# Altium schematic sheet Rooftop Unit for AgOpenGPS.schdoc
size 400 x 287 mm
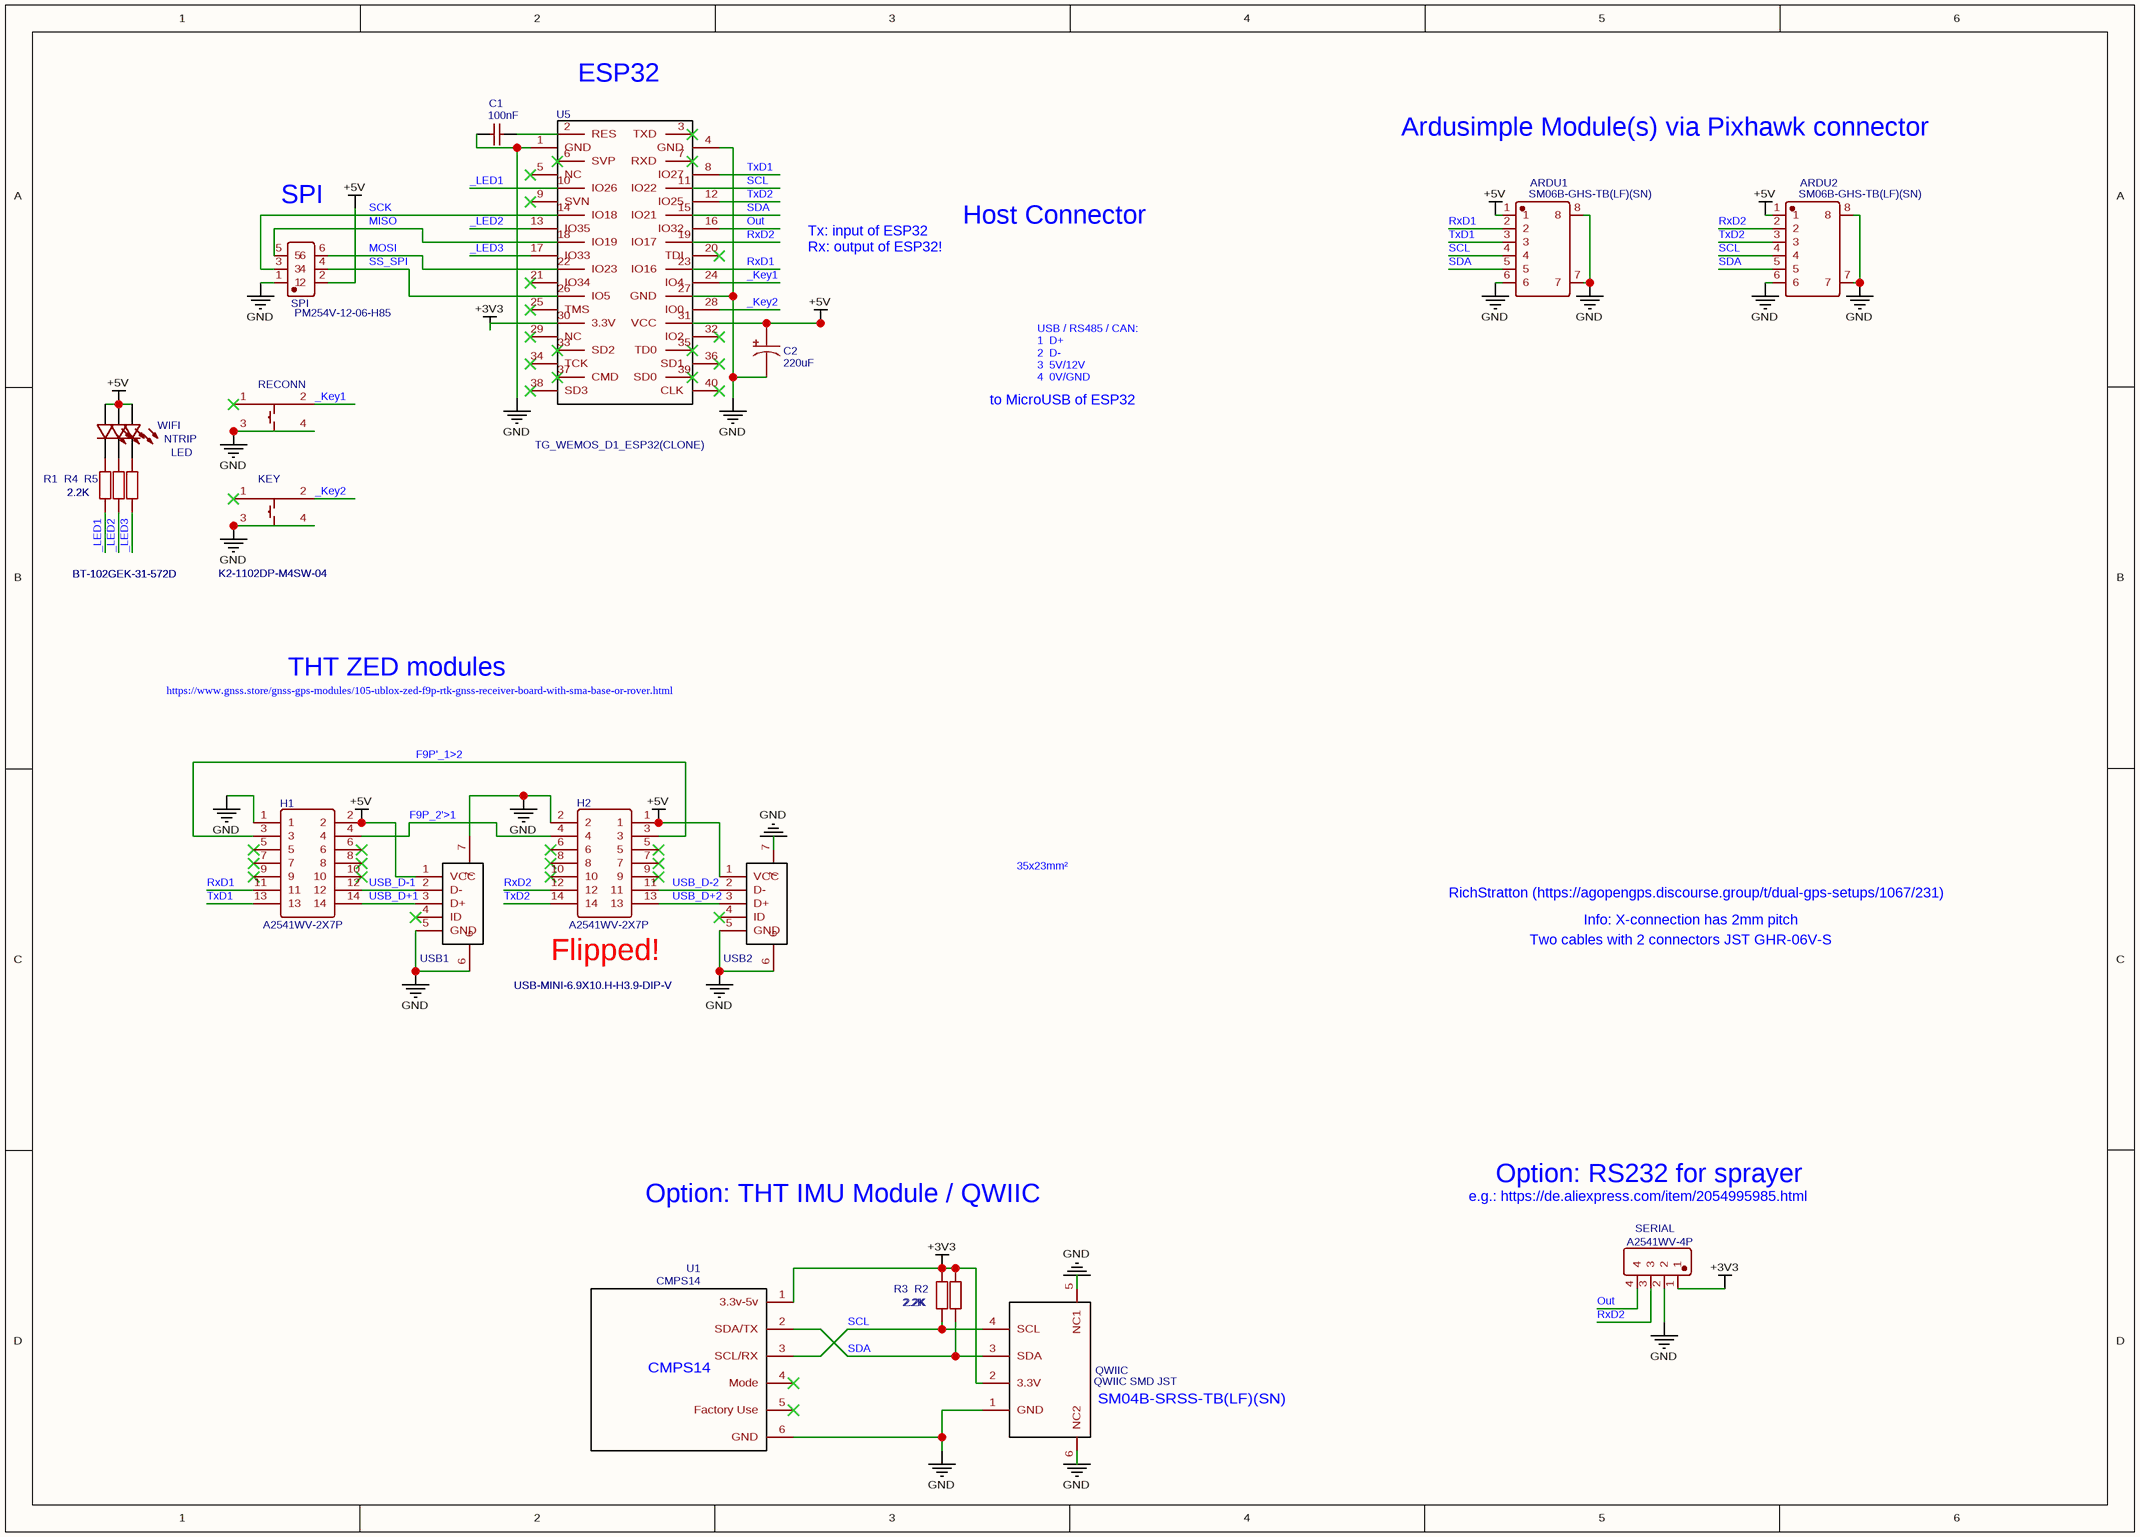
[diagram p0: Rooftop Unit for AgOpenGPS.schdoc]

## Parts
ARDU1  SM06B-GHS-TB(LF)(SN)  [CONN-TH_SM06B-GHS-TB-LF-SN]
ARDU2  SM06B-GHS-TB(LF)(SN)  [CONN-TH_SM06B-GHS-TB-LF-SN]
C1  100nF  [CAP-TH_L5.0-W2.5-P5.08-D0.7]
C2  220uF  [CAP-TH_BD6.3-P2.50-D1.0-FD]
H1  A2541WV-2X7P  [HDR-TH_14P-P2.54-V-R2-C7-S2.54_A2541WV-2X7P]
H2  A2541WV-2X7P  [HDR-TH_14P-P2.54-V-R2-C7-S2.54_A2541WV-2X7P]
KEY  K2-1102DP-M4SW-04  [KEY-TH_4P-L6.0-W6.0-P4.50-LS7.5]
LED  BT-102GEK-31-572D  [LED-TH_BD3.8-P2.54-FD]
NTRIP  BT-102GEK-31-572D  [LED-TH_BD3.8-P2.54-FD]
QWIIC  QWIIC SMD JST  [QWIIC CONNECTOR]
R1  2.2K  [RES-TH_BD2.4-L6.3-P10.30-D0.6]
R2  2.2K  [RES-TH_BD2.4-L6.3-P10.30-D0.6]
R3  2.2K  [RES-TH_BD2.4-L6.3-P10.30-D0.6]
R4  2.2K  [RES-TH_BD2.4-L6.3-P10.30-D0.6]
R5  2.2K  [RES-TH_BD2.4-L6.3-P10.30-D0.6]
RECONN  K2-1102DP-M4SW-04  [KEY-TH_4P-L6.0-W6.0-P4.50-LS7.5]
SERIAL  A2541WV-4P  [HDR-TH_4P-P2.54-V]
SPI  PM254V-12-06-H85  [HDR-TH_6P-P2.54-V-F-R2-C3-S2.54]
U1  CMPS14  [CMPS14]
U5  TG_WEMOS_D1_ESP32(CLONE)  [WEMOS-D1 ESP32]
USB1  USB-MINI-6.9X10.H-H3.9-DIP-V  [MINI-USB-TH_C13453]
USB2  USB-MINI-6.9X10.H-H3.9-DIP-V  [MINI-USB-TH_C13453]
WIFI  BT-102GEK-31-572D  [LED-TH_BD3.8-P2.54-FD]

## Nets
+3V3: QWIIC.2(3.3V) R2.2 R3.2 SERIAL.1 U1.1(3.3v-5v) U5.30(3.3V)
+5V: ARDU1.1 ARDU2.1 C2.1 H1.2 H2.1 LED.1 NTRIP.1 SPI.2 U5.31(VCC) USB1.1(VCC) USB2.1(VCC) WIFI.1
GND: ARDU1.6 ARDU1.7 ARDU1.8 ARDU2.6 ARDU2.7 ARDU2.8 C1.1 C2.2 H1.1 H2.2 KEY.3 KEY.4 QWIIC.1(GND) QWIIC.5(NC1) QWIIC.6(NC2) RECONN.3 RECONN.4 SERIAL.2 SPI.1 U1.6(GND) U5.1(GND) U5.4(GND) U5.27(GND) USB1.5(GND) USB1.6 USB1.7 USB2.5(GND) USB2.6 USB2.7
_Key1: RECONN.2 U5.24(IO4)
_Key2: KEY.2 U5.28(IO0)
_LED1: R1.1 U5.10(IO26)
_LED2: R4.1 U5.13(IO35)
_LED3: R5.1 U5.17(IO33)
F9P'_1>2: H1.3 H2.3
F9P_2'>1: H1.4 H2.4
MISO: SPI.5 U5.18(IO19)
MOSI: SPI.6 U5.22(IO23)
Out: SERIAL.4 U5.16(IO32)
RxD1: ARDU1.2 H1.11 U5.23(IO16)
RxD2: ARDU2.2 H2.12 SERIAL.3 U5.19(IO17)
SCK: SPI.3 U5.14(IO18)
SCL: ARDU1.4 ARDU2.4 QWIIC.4(SCL) R3.1 U1.3(SCL/RX) U5.11(IO22)
SDA: ARDU1.5 ARDU2.5 QWIIC.3(SDA) R2.1 U1.2(SDA/TX) U5.15(IO21)
SS_SPI: SPI.4 U5.26(IO5)
TxD1: ARDU1.3 H1.13 U5.8(IO27)
TxD2: ARDU2.3 H2.14 U5.12(IO25)
USB_D+1: H1.14 USB1.3(D+)
USB_D+2: H2.13 USB2.3(D+)
USB_D-1: H1.12 USB1.2(D-)
USB_D-2: H2.11 USB2.2(D-)
NetC1_2: C1.2 U5.2(RES)
NetLED_2: LED.2 R5.2
NetNTRIP_2: NTRIP.2 R4.2
NetR1_2: R1.2 WIFI.2

Not connected (* = marked no-connect by the designer): H1 5* 6* 7* 8* 9* 10*; H2 5* 6* 7* 8* 9* 10*; KEY 1*; RECONN 1*; U1 4(Mode)* 5(Factory_Use)*; U5 3(TXD)* 5(NC)* 6(SVP)* 7(RXD)* 9(SVN)* 20(TDI)* 21(IO34)* 25(TMS)* 29(NC)* 32(IO2)* 33(SD2)* 34(TCK)* 35(TD0)* 36(SD1)* 37(CMD)* 38(SD3)* 39(SD0)* 40(CLK)*; USB1 4(ID)*; USB2 4(ID)*

## Notes on the sheet
- (near U5) ESP32
- Ardusimple Module(s) via Pixhawk connector
- (near SPI) SPI
- (near C2) Tx: input of ESP32
  Rx: output of ESP32!
- Host Connector
- USB / RS485 / CAN:
  1  D+
  2  D-
  3  5V/12V
  4  0V/GND
- to MicroUSB of ESP32
- THT ZED modules
- https://www.gnss.store/gnss-gps-modules/105-ublox-zed-f9p-rtk-gnss-receiver-board-with-sma-base-or-rover.html
- 35x23mm²
- RichStratton (https://agopengps.discourse.group/t/dual-gps-setups/1067/231)
- Two cables with 2 connectors JST GHR-06V-S
- Info: X-connection has 2mm pitch
- (near H2) Flipped!
- Option: THT IMU Module / QWIIC
- e.g.: https://de.aliexpress.com/item/2054995985.html
- Option: RS232 for sprayer
- (near QWIIC) SM04B-SRSS-TB(LF)(SN)

## Library data of the parts
ARDU1 ARDU2 = SM06B-GHS-TB(LF)(SN): BOM_Manufacturer: JST Sales America; Contributor: LCSC; BOM_Supplier: LCSC; BOM_Supplier Part: C133065; BOM_Manufacturer Part: SM06B-GHS-TB(LF)(SN); spicePre: C; spiceSymbolName: SM06B-GHS-TB(LF)(SN)
C1 = 100nF: BOM_Manufacturer: KEMET; BOM_Manufacturer Part: C320C104K5R5TA7303; nameAlias: Capacitance; Contributor: LCSC; BOM_Supplier: LCSC; BOM_Supplier Part: C236029; spicePre: C; spiceSymbolName: C320C104K5R5TA7303
C2 = 220uF: BOM_Manufacturer: Nichicon; BOM_Manufacturer Part: UPW1A221MED1TD; nameAlias: Capacitance; Contributor: LCSC; BOM_Supplier: LCSC; BOM_Supplier Part: C225866; spicePre: C; spiceSymbolName: UPW1A221MED1TD
H1 H2 = A2541WV-2X7P: BOM_Manufacturer: Changjiang Connectors; Contributor: LCSC; BOM_Supplier: LCSC; BOM_Supplier Part: C225522; BOM_Manufacturer Part: A2541WV-2x7P; spicePre: H; spiceSymbolName: A2541WV-2X7P
KEY RECONN = K2-1102DP-M4SW-04: BOM_Manufacturer: HRO; Contributor: LCSC; BOM_Supplier: LCSC; BOM_Manufacturer Part: K2-1102DP-M4SW-04; BOM_Supplier Part: C136678; spicePre: S; spiceSymbolName: K2-1102DP-M4SW-04
LED NTRIP WIFI = BT-102GEK-31-572D: BOM_Manufacturer: NATIONSTAR; BOM_Supplier: LCSC; BOM_Manufacturer Part: BT-102GEK-31-572D; BOM_Supplier Part: C93096; spicePre: L; spiceSymbolName: BT-102GEK-31-572D
QWIIC = QWIIC SMD JST: BOM_Manufacturer: JST Sales America; BOM_Manufacturer Part: SM04B-SRSS-TB(LF)(SN); Contributor: donhagen; BOM_Supplier: Sparkfun; BOM_Supplier Part: PRT-14417; link: https://www.sparkfun.com/products/14417; spicePre: U; spiceSymbolName: QWIIC SMD JST
R1-R5 = 2.2K: BOM_Manufacturer: Futaba Elec; BOM_Manufacturer Part: RNU18F2201A520NH; nameAlias: Resistance (Ohms); Contributor: LCSC; BOM_Supplier: LCSC; BOM_Supplier Part: C274429; spicePre: R; spiceSymbolName: RNU18F2201A520NH
SERIAL = A2541WV-4P: BOM_Manufacturer: Changjiang Connectors; Contributor: LCSC; BOM_Supplier: LCSC; BOM_Supplier Part: C225479; BOM_Manufacturer Part: A2541WV-4P; spicePre: H; spiceSymbolName: A2541WV-4P
SPI = PM254V-12-06-H85: BOM_Manufacturer: XFCN; Contributor: LCSC; BOM_Supplier: LCSC; BOM_Supplier Part: C541853; BOM_Manufacturer Part: PM254V-12-06-H85; spicePre: H; spiceSymbolName: PM254V-12-06-H85
U1 = CMPS14: Contributor: FixyNeko; spicePre: U; spiceSymbolName: CMPS14
U5 = TG_WEMOS_D1_ESP32(CLONE): BOM_Manufacturer Part: New SchematicLib; Contributor: John Archbold; BOM_Supplier Part: undefined; spicePre: U; spiceSymbolName: TG_WEMOS_D1_ESP32(CLONE)
USB1 USB2 = USB-MINI-6.9X10.H-H3.9-DIP-V: BOM_Manufacturer: LCSC; BOM_Supplier: LCSC; BOM_Supplier Part: C13453; BOM_Manufacturer Part: USB-MINI-6.9X10.H-H3.9-DIP-V; Contributor: LCSC; spicePre: U; spiceSymbolName: USB-MINI-6.9X10.H-H3.9-DIP-V